# EAGLE design CentralBoard (EAGLE 9.2.2)
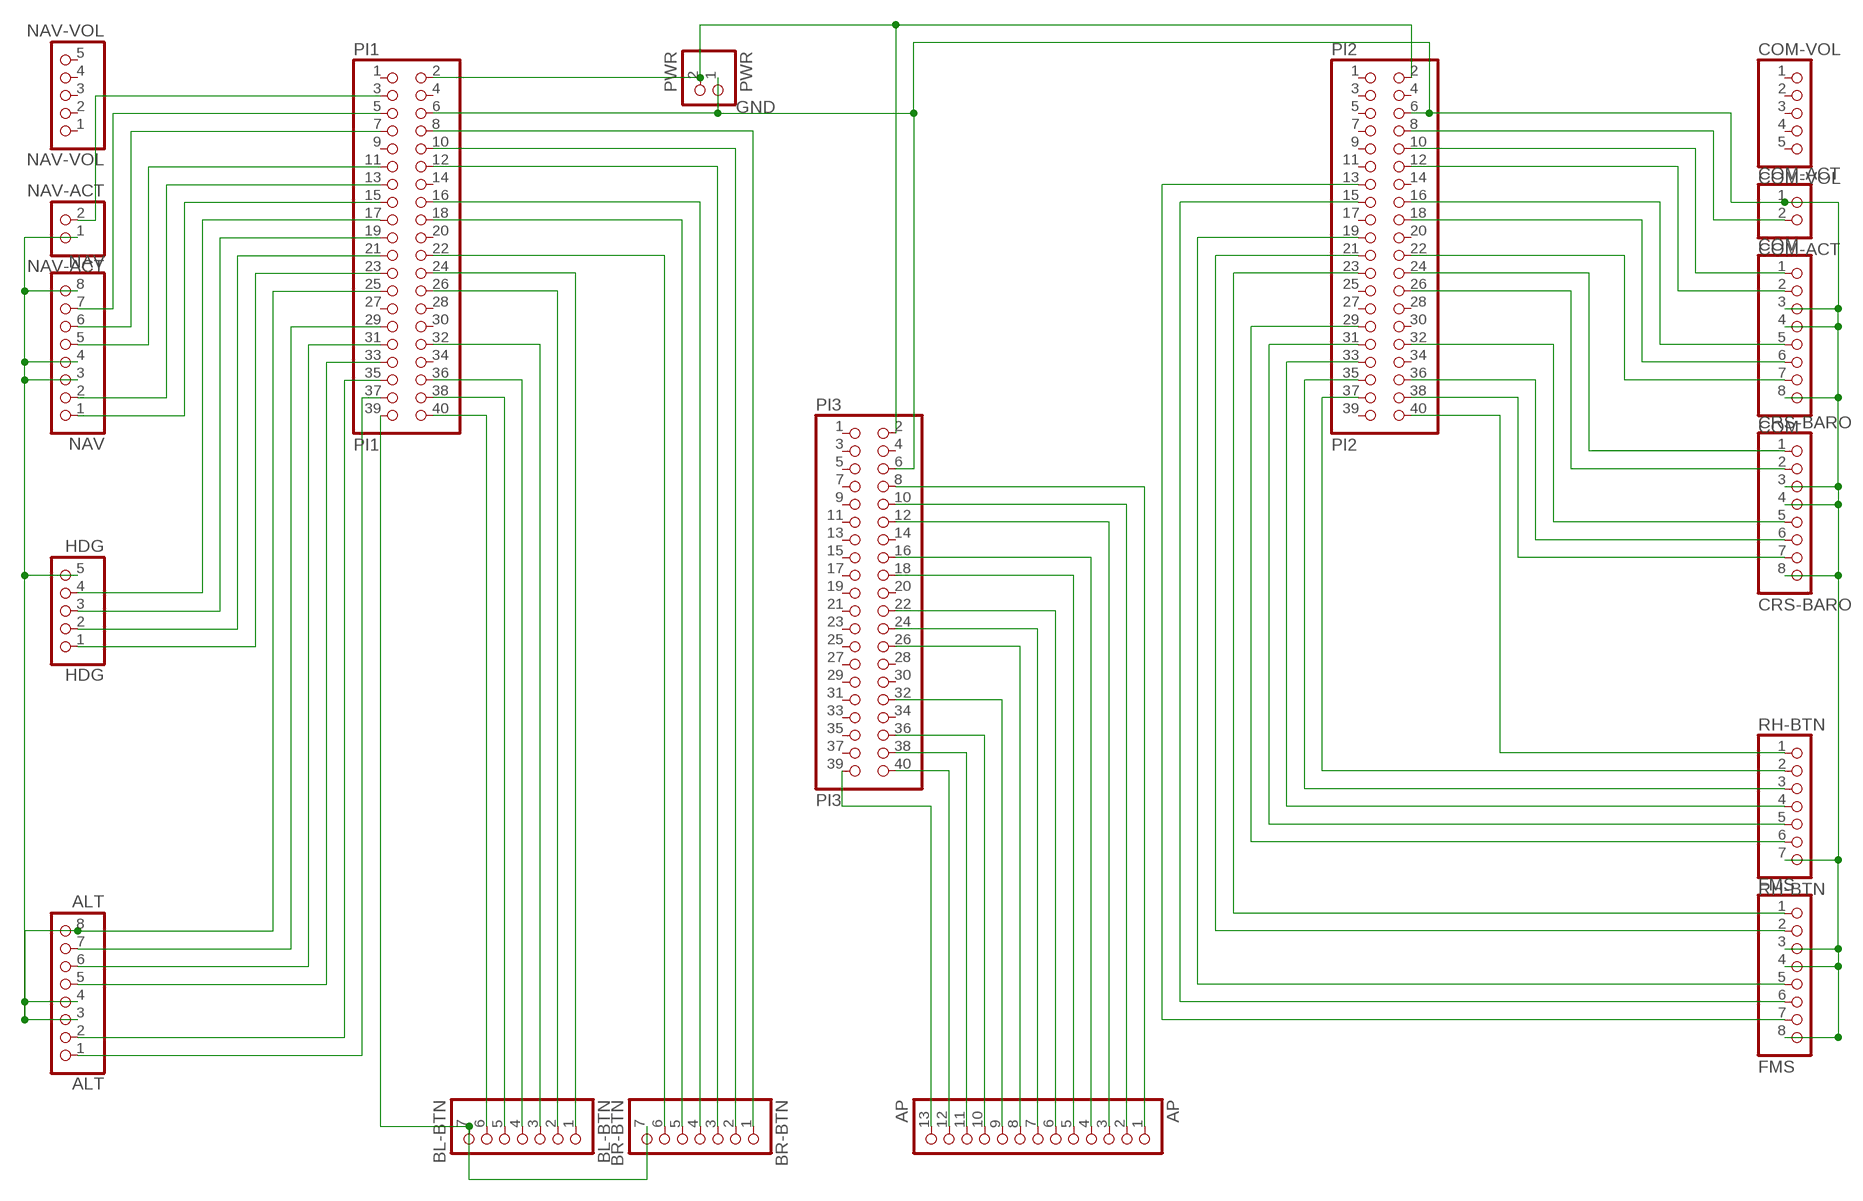
[diagram p0: schematic, sheet 1]

## Parts
ALT  ALT  PINHD-1X8/90  [1X08/90]
AP  AP  PINHD-1X13  [1X13]
BL-BTN  BL-BTN  PINHD-1X7/90  [1X07/90]
BR-BTN  BR-BTN  PINHD-1X7  [1X07]
COM  COM  PINHD-1X8/90  [1X08/90]
COM-ACT  COM-ACT  PINHD-1X2/90  [1X02/90]
COM-VOL  COM-VOL  PINHD-1X5/90  [1X05/90]
CRS-BARO  CRS-BARO  PINHD-1X8/90  [1X08/90]
FMS  FMS  PINHD-1X8/90  [1X08/90]
HDG  HDG  PINHD-1X5/90  [1X05/90]
NAV  NAV  PINHD-1X8/90  [1X08/90]
NAV-ACT  NAV-ACT  PINHD-1X2/90  [1X02/90]
NAV-VOL  NAV-VOL  PINHD-1X5/90  [1X05/90]
PI1  PI1  PINHD-2X20  [2X20]
PI2  PI2  PINHD-2X20  [2X20]
PI3  PI3  PINHD-2X20  [2X20]
PWR  PWR  PINHD-1X2/90  [1X02/90]
RH-BTN  RH-BTN  PINHD-1X7/90  [1X07/90]

## Nets
GND [power]: COM-ACT.1 COM.3 COM.4 COM.8 CRS-BARO.3 CRS-BARO.4 CRS-BARO.8 FMS.3 FMS.4 FMS.8 PI1.6 PI2.6 PI3.6 PWR.1 RH-BTN.7
N$1: CRS-BARO.6 PI2.36
N$2: HDG.3 PI1.19
N$3: BL-BTN.7 BR-BTN.7 PI1.39
N$4: CRS-BARO.7 PI2.38
N$5: BL-BTN.6 PI1.40
N$6: BL-BTN.5 PI1.38
N$7: ALT.7 PI1.29
N$8: ALT.3 ALT.4 ALT.8 HDG.5 NAV-ACT.1 NAV.3 NAV.4 NAV.8 PI1.25
N$9: NAV.7 PI1.5
N$10: NAV.6 PI1.7
N$11: NAV.2 PI1.13
N$12: NAV.1 PI1.15
N$13: NAV.5 PI1.11
N$14: HDG.2 PI1.21
N$15: HDG.1 PI1.23
N$16: COM.2 PI2.12
N$17: ALT.6 PI1.31
N$18: ALT.5 PI1.33
N$19: ALT.2 PI1.35
N$20: ALT.1 PI1.37
N$21: NAV-ACT.2 PI1.3
N$22: BR-BTN.6 PI1.22
N$23: BR-BTN.5 PI1.18
N$24: HDG.4 PI1.17
N$25: BL-BTN.4 PI1.36
N$26: BL-BTN.3 PI1.32
N$27: BL-BTN.2 PI1.26
N$28: BL-BTN.1 PI1.24
N$29: BR-BTN.4 PI1.16
N$30: BR-BTN.3 PI1.12
N$31: BR-BTN.2 PI1.10
N$32: BR-BTN.1 PI1.8
N$33: COM.1 PI2.10
N$34: COM-ACT.2 PI2.8
N$35: PI2.31 RH-BTN.5
N$36: FMS.2 PI2.21
N$37: PI2.29 RH-BTN.6
N$38: AP.2 PI3.10
N$39: AP.3 PI3.12
N$40: AP.1 PI3.8
N$41: CRS-BARO.1 PI2.24
N$42: CRS-BARO.2 PI2.26
N$43: CRS-BARO.5 PI2.32
N$44: AP.4 PI3.16
N$45: FMS.5 PI2.19
N$46: AP.5 PI3.18
N$47: AP.6 PI3.22
N$48: PI2.40 RH-BTN.1
N$49: PI2.37 RH-BTN.2
N$50: PI2.35 RH-BTN.3
N$51: PI2.33 RH-BTN.4
N$52: AP.7 PI3.24
N$53: FMS.1 PI2.23
N$54: AP.8 PI3.26
N$55: AP.9 PI3.32
N$56: FMS.6 PI2.15
N$57: FMS.7 PI2.13
N$58: AP.10 PI3.36
N$59: AP.11 PI3.38
N$60: AP.12 PI3.40
N$61: AP.13 PI3.39
N$63 [power]: PI1.2 PI2.2 PI3.2 PWR.2
N$77: COM.5 PI2.16
N$78: COM.6 PI2.18
N$79: COM.7 PI2.22
Unconnected: COM-VOL.1 COM-VOL.2 COM-VOL.3 COM-VOL.4 COM-VOL.5 NAV-VOL.1 NAV-VOL.2 NAV-VOL.3 NAV-VOL.4 NAV-VOL.5 PI1.1 PI1.4 PI1.9 PI1.14 PI1.20 PI1.27 PI1.28 PI1.30 PI1.34 PI2.1 PI2.3 PI2.4 PI2.5 PI2.7 PI2.9 PI2.11 PI2.14 PI2.17 PI2.20 PI2.25 PI2.27 PI2.28 PI2.30 PI2.34 PI2.39 PI3.1 PI3.3 PI3.4 PI3.5 PI3.7 PI3.9 PI3.11 PI3.13 PI3.14 PI3.15 PI3.17 PI3.19 PI3.20 PI3.21 PI3.23 PI3.25 PI3.27 PI3.28 PI3.29 PI3.30 PI3.31 PI3.33 PI3.34 PI3.35 PI3.37

## Library data of the parts
ALT COM CRS-BARO FMS NAV = pinhead:PINHD-1X8: PIN HEADER
AP = pinhead:PINHD-1X13: PIN HEADER
BL-BTN BR-BTN RH-BTN = pinhead:PINHD-1X7: PIN HEADER
COM-ACT NAV-ACT PWR = pinhead:PINHD-1X2: PIN HEADER
COM-VOL HDG NAV-VOL = pinhead:PINHD-1X5: PIN HEADER
PI1-PI3 = pinhead:PINHD-2X20: PIN HEADER

## Net classes
0 default: width 0.254 mm, clearance 0.203 mm
1 power: width 1.372 mm, clearance 0.203 mm

## Board
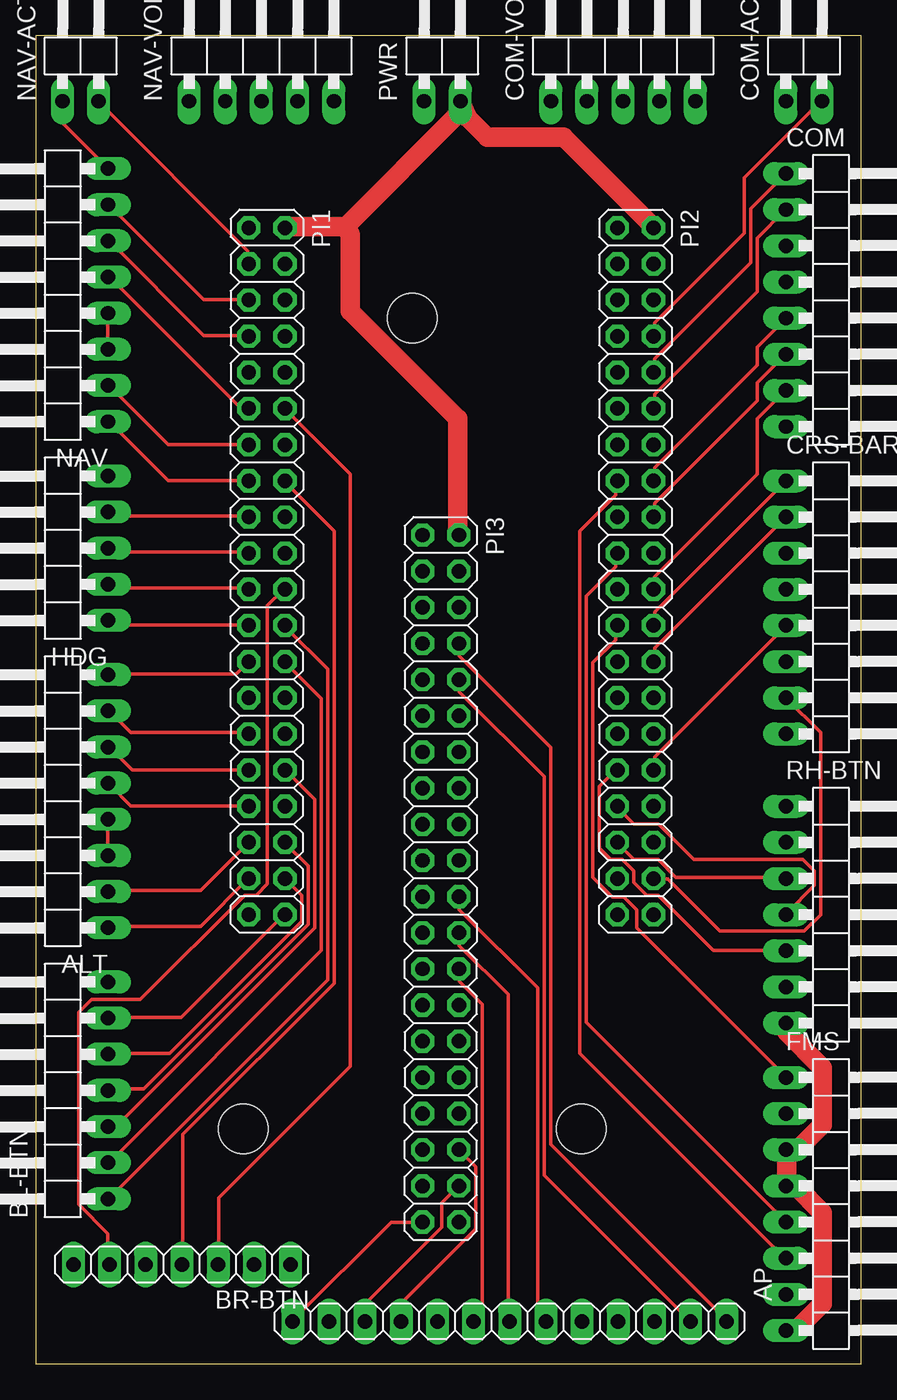
[diagram p1: board, top side]
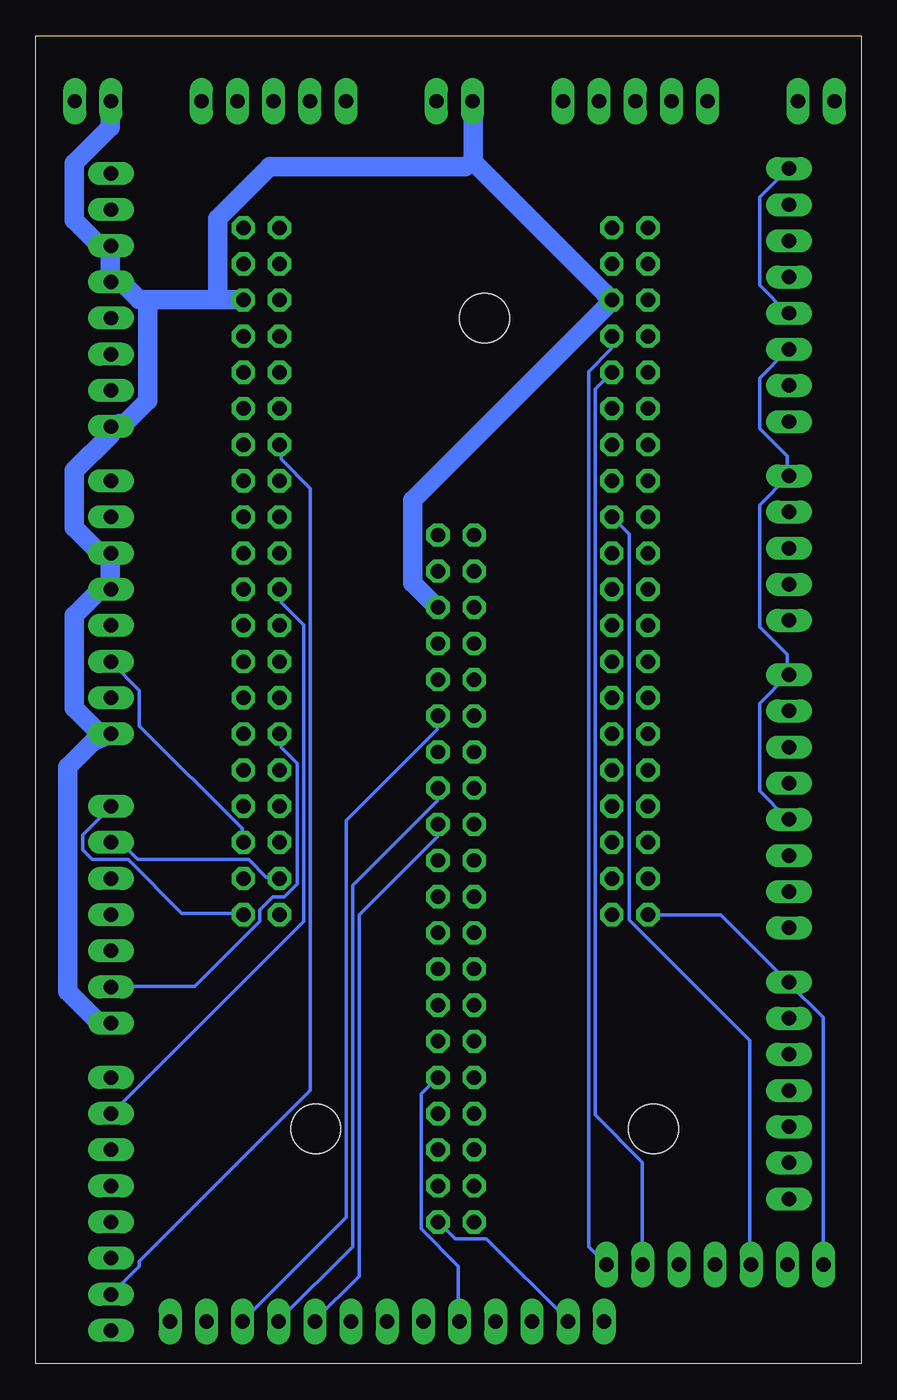
[diagram p2: board, bottom side, seen from below]

Size 57.98 x 93.32 mm. Coordinates in mm from the lower left corner, seen from the top.
Outline: 0,0 57.98,0 57.98,93.32 0,93.32 0,0
Copper layers (1*16): Top 0.035mm / dielectric 1.5mm / Bottom 0.035mm
Design rules "SparkFun": minimum track width 8mil, minimum drill 20mil, track to track 8mil, track to pad 8mil, pad to pad 8mil, via to via 8mil, smd to smd 8mil, copper to edge 10mil, drill to drill 8mil, minimum pad ring 12mil, minimum via ring 10mil, stop-mask expansion 4mil, vias tented up to drill 25mil, thermal gap 10mil
Holes 3.5 mm at 26.45,73.47 14.59,16.51 38.31,16.51

### Footprints (pad centres in the part's own frame; a part is rotated, then mirrored left to right if it is on the bottom)
1X08/90 = drill 1.016 long: 1 -8.89,-3.81; 2 -6.35,-3.81; 3 -3.81,-3.81; 4 -1.27,-3.81; 5 1.27,-3.81; 6 3.81,-3.81; 7 6.35,-3.81; 8 8.89,-3.81
1X13 = drill 1.016 long: 1 -15.24,0; 2 -12.7,0; 3 -10.16,0; 4 -7.62,0; 5 -5.08,0; 6 -2.54,0; 7 0,0; 8 2.54,0; 9 5.08,0; 10 7.62,0; 11 10.16,0; 12 12.7,0; 13 15.24,0
1X07/90 = drill 1.016 long: 1 -7.62,-3.81; 2 -5.08,-3.81; 3 -2.54,-3.81; 4 0,-3.81; 5 2.54,-3.81; 6 5.08,-3.81; 7 7.62,-3.81
1X07 = drill 1.016 long: 1 -7.62,0; 2 -5.08,0; 3 -2.54,0; 4 0,0; 5 2.54,0; 6 5.08,0; 7 7.62,0
1X02/90 = drill 1.016 long: 1 -1.27,-3.81; 2 1.27,-3.81
1X05/90 = drill 1.016 long: 1 -5.08,-3.81; 2 -2.54,-3.81; 3 0,-3.81; 4 2.54,-3.81; 5 5.08,-3.81
2X20 = drill 1.016 octagon: 1 -24.13,-1.27; 2 -24.13,1.27; 3 -21.59,-1.27; 4 -21.59,1.27; 5 -19.05,-1.27; 6 -19.05,1.27; 7 -16.51,-1.27; 8 -16.51,1.27; 9 -13.97,-1.27; 10 -13.97,1.27; 11 -11.43,-1.27; 12 -11.43,1.27; 13 -8.89,-1.27; 14 -8.89,1.27; 15 -6.35,-1.27; 16 -6.35,1.27; 17 -3.81,-1.27; 18 -3.81,1.27; 19 -1.27,-1.27; 20 -1.27,1.27; 21 1.27,-1.27; 22 1.27,1.27; 23 3.81,-1.27; 24 3.81,1.27; 25 6.35,-1.27; 26 6.35,1.27; 27 8.89,-1.27; 28 8.89,1.27; 29 11.43,-1.27; 30 11.43,1.27; 31 13.97,-1.27; 32 13.97,1.27; 33 16.51,-1.27; 34 16.51,1.27; 35 19.05,-1.27; 36 19.05,1.27; 37 21.59,-1.27; 38 21.59,1.27; 39 24.13,-1.27; 40 24.13,1.27

### Placement (x,y rotation side)
ALT  1.27,39.53 90 top
AP  33.29,2.99 180 top
BL-BTN  1.27,19.21 90 top
BR-BTN  10.27,6.98 180 top
COM  56.5,74.74 270 top
COM-ACT  53.96,92.52 0 top
COM-VOL  41.26,92.52 0 top
CRS-BARO  56.5,53.15 270 top
FMS  56.5,11.24 270 top
HDG  1.27,57.31 90 top
NAV  1.27,75.09 90 top
NAV-ACT  3.16,92.52 0 top
NAV-VOL  15.86,92.52 0 top
PI1  16.24,55.69 270 top
PI2  42.12,55.69 270 top
PI3  28.45,34.1 270 top
PWR  28.56,92.52 0 top
RH-BTN  56.5,31.56 270 top

### Tracks (layer width: path | path; a pad name or v marks a point on that pad's centre or on a via)
GND
  Top 1.372: FMS.8 52.74,2.4 53.43,2.4 55.25,4.23 55.25,10.63 53.43,12.46 52.74,12.46 FMS.4 52.74,13.14 52.74,14.97 FMS.3 53.43,14.97 55.25,16.8 55.25,20.8 52.74,23.32 52.74,23.89 RH-BTN.7
  Bottom 1.372: PI3.6 29.77,53.15 31.48,54.86 31.48,60.69 17.54,74.64 PI1.6 17.99,75.21 27.25,84.47 | 27.25,84.47 27.25,88.7 PWR.1 | 50.11,74.75 50.68,74.75 51.94,76.01 COM.4 52.74,76.58 52.74,78.53 COM.3 53.43,78.53 55.25,80.35 55.25,84.35 52.74,86.87 52.74,88.7 COM-ACT.1 | 50.11,74.75 45.2,74.75 | 45.2,74.75 43.48,74.75 PI2.6 | RH-BTN.7 52.74,24 53.54,24 55.71,26.18 55.71,41.95 53.88,43.78 CRS-BARO.8 52.74,44.35 53.54,44.35 55.25,46.06 55.25,52.58 53.43,54.41 52.74,54.41 CRS-BARO.4 52.74,55.09 52.74,56.92 CRS-BARO.3 53.43,56.92 55.25,58.75 55.25,62.75 52.74,65.27 52.74,65.84 COM.8 52.05,66.07 51.71,66.07 50.11,67.67 50.11,74.75 | 45.2,74.75 45.2,80.47 41.54,84.12 27.82,84.12 27.25,84.47
N$1
  Bottom 0.254: PI2.36 43.48,36.69 43.48,37.6 50.68,44.81 50.68,47.32 52.63,49.26 CRS-BARO.6
N$2
  Top 0.254: PI1.19 14.91,57.04 5.42,57.04 5.19,57.27 HDG.3
N$3
  Bottom 0.254: BR-BTN.7 2.68,7.09 2.68,24.35 5.08,26.75 BL-BTN.7 5.19,26.86 9.88,31.55 14.91,31.55 PI1.39
N$4
  Top 0.254: CRS-BARO.7 55.14,44.35 55.14,31.55 54,30.4 48.05,30.4 44.4,34.06 43.48,34.06 PI2.38
N$5
  Top 0.254: BL-BTN.6 5.19,24.35 10.22,24.35 17.42,31.55 PI1.40
N$6
  Top 0.254: BL-BTN.5 5.19,21.83 9.42,21.83 18.68,31.09 18.68,32.92 17.54,34.06 PI1.38
N$7
  Top 0.254: PI1.29 14.91,44.35 6.68,44.35 5.19,45.84 ALT.7
N$8
  Top 0.254: ALT.3 5.08,35.78 5.08,38.18 ALT.4 | ALT.8 5.19,48.46 14.11,48.46 14.91,49.26 PI1.25 | NAV-ACT.1 1.99,88.7 1.99,87.1 5.08,84.01 NAV.8 | NAV.4 5.08,73.72 5.08,71.32 NAV.3
  Bottom 0.254: ALT.4 5.19,38.29 7.13,40.23 7.13,46.41 5.19,48.35 ALT.8 5.19,48.46 5.19,49.84 7.13,51.78 7.13,60.35 5.19,62.29 HDG.5 5.19,62.41 5.19,63.78 7.13,65.72 7.13,69.27 5.19,71.21 NAV.3 | NAV.8 5.19,83.9 7.13,81.95 7.13,75.78 5.19,73.84 NAV.4
N$9
  Top 0.254: PI1.5 14.91,74.75 11.82,74.75 5.19,81.38 NAV.7
N$10
  Top 0.254: PI1.7 14.91,72.24 11.82,72.24 5.19,78.87 NAV.6
N$11
  Top 0.254: PI1.13 9.31,64.58 5.19,68.69 NAV.2
N$12
  Top 0.254: PI1.15 14.91,62.06 9.31,62.06 5.19,66.18 NAV.1
N$13
  Top 0.254: PI1.11 14.91,67.21 14.34,67.21 5.19,76.35 NAV.5
N$14
  Top 0.254: PI1.21 14.91,54.52 5.42,54.52 5.19,54.75 HDG.2
N$15
  Top 0.254: PI1.23 14.91,51.89 5.42,51.89 5.19,52.12 HDG.1
N$16
  Top 0.254: PI2.12 43.48,67.21 43.48,68.12 50.68,75.32 50.68,79.1 52.63,81.04 COM.2
N$17
  Top 0.254: PI1.31 6.79,41.72 5.19,43.32 ALT.6
N$18
  Top 0.254: PI1.33 14.91,39.2 6.68,39.2 5.19,40.69 ALT.5
N$19
  Top 0.254: ALT.2 5.19,33.26 11.59,33.26 14.91,36.58 PI1.35
N$20
  Top 0.254: ALT.1 5.19,30.75 11.59,30.75 14.91,34.06 PI1.37
N$21
  Top 0.254: PI1.3 14.91,77.38 14.91,78.18 4.39,88.7 NAV-ACT.2
N$22
  Top 0.254: BR-BTN.6 5.08,7.09 5.08,9.14 3.02,11.2 3.02,24.69 3.93,25.6 7.36,25.6 14.68,32.92 15.48,32.92 16.28,33.72 16.28,53.26 17.42,54.41 PI1.22
N$23
  Bottom 0.254: BR-BTN.5 7.82,7.09 7.82,22.75 16.28,31.2 16.28,58.29 17.42,59.44 PI1.18
N$24
  Top 0.254: PI1.17 14.91,59.55 5.42,59.55 5.19,59.78 HDG.4
N$25
  Top 0.254: BL-BTN.4 5.19,19.32 7.59,19.32 19.14,30.86 19.14,34.98 17.54,36.58 PI1.36
N$26
  Top 0.254: BL-BTN.3 5.19,16.69 5.65,16.69 19.59,30.63 19.59,39.66 17.54,41.72 PI1.32
N$27
  Top 0.254: BL-BTN.2 5.19,14.17 20.05,29.03 20.05,46.75 17.54,49.26 PI1.26
N$28
  Top 0.254: BL-BTN.1 5.19,11.66 20.51,26.98 20.51,48.81 17.54,51.78 PI1.24
N$29
  Top 0.254: BR-BTN.4 10.33,7.09 10.33,16.12 20.96,26.75 20.96,58.52 17.54,61.95 PI1.16
N$30
  Top 0.254: BR-BTN.3 12.85,7.09 12.85,11.66 22.11,20.92 22.11,62.52 17.54,67.09 PI1.12
N$31
  Bottom 0.254: BR-BTN.2 15.37,7.09 15.37,14.17 18.68,17.49 18.68,68.47 17.54,69.61 PI1.10
N$32
  Bottom 0.254: PI1.8 17.54,72.12 17.54,71.32 19.14,69.72 19.14,8.23 17.99,7.09 BR-BTN.1
N$33
  Top 0.254: PI2.10 43.48,69.72 43.48,70.64 50.23,77.38 50.23,81.15 52.63,83.55 COM.1
N$34
  Top 0.254: PI2.8 43.48,72.24 43.48,73.15 49.77,79.44 49.77,83.33 55.14,88.7 COM-ACT.2
N$35
  Top 0.254: RH-BTN.5 52.63,29.03 47.6,29.03 43.71,32.92 42.91,32.92 42,33.83 42,34.63 41.2,35.43 40.4,35.43 39.6,36.23 39.6,40.58 40.74,41.72 PI2.31
N$36
  Bottom 0.254: PI2.21 40.74,54.41 40.74,53.49 39.14,51.89 39.14,31.09 52.63,17.6 FMS.2
N$37
  Bottom 0.254: PI2.29 40.74,44.23 40.74,43.32 39.6,42.18 39.6,33.72 40.51,32.8 41.31,32.8 42.22,31.89 42.22,31.09 46.8,26.52 52.63,26.52 RH-BTN.6
N$38
  Top 0.254: PI3.10 29.77,48.01 29.77,47.21 35.71,41.26 35.71,13.26 45.88,3.09 AP.2
N$39
  Bottom 0.254: PI3.12 29.77,45.49 29.77,44.58 36.17,38.18 36.17,10.29 43.37,3.09 AP.3
N$40
  Top 0.254: PI3.8 29.77,50.52 29.77,49.72 36.17,43.32 36.17,15.43 48.51,3.09 AP.1
N$41
  Top 0.254: PI2.24 43.48,51.89 43.48,52.81 52.63,61.95 CRS-BARO.1
N$42
  Top 0.254: CRS-BARO.2 43.48,50.29 43.48,49.38 PI2.26
N$43
  Top 0.254: PI2.32 43.48,41.72 43.48,42.63 52.63,51.78 CRS-BARO.5
N$44
  Bottom 0.254: PI3.16 29.77,40.35 29.77,39.55 35.71,33.6 35.71,8.23 40.85,3.09 AP.4
N$45
  Top 0.254: PI2.19 40.74,56.92 40.74,56.01 38.68,53.95 38.68,24 52.63,10.06 FMS.5
N$46
  Bottom 0.254: PI3.18 29.77,37.83 29.77,37.03 35.25,31.55 35.25,6.17 38.34,3.09 AP.5
N$47
  Top 0.254: PI3.22 29.77,32.8 29.77,31.89 35.25,26.4 35.25,3.66 35.82,3.09 AP.6
N$48
  Bottom 0.254: PI2.40 43.48,31.66 47.71,31.66 51.48,35.43 54,35.43 54.68,36.12 54.68,37.15 52.74,39.09 RH-BTN.1
N$49
  Bottom 0.254: PI2.37 40.85,34.18 41.77,34.18 43.02,35.43 50.8,35.43 51.94,36.58 52.63,36.58 RH-BTN.2
N$50
  Top 0.254: RH-BTN.3 52.63,34.18 44.97,34.18 43.71,35.43 42,35.43 40.85,36.58 PI2.35
N$51
  Top 0.254: RH-BTN.4 52.74,31.66 54.68,33.6 54.68,34.63 53.88,35.43 46.23,35.43 43.71,37.95 42,37.95 40.85,39.09 PI2.33
N$52
  Top 0.254: PI3.24 29.77,30.29 29.77,29.38 33.2,25.95 33.2,3.09 AP.7
N$53
  Top 0.254: PI2.23 40.74,51.78 40.74,50.86 39.14,49.26 39.14,34.18 40.51,32.8 41.31,32.8 42.22,31.89 42.22,30.63 52.63,20.23 FMS.1
N$54
  Top 0.254: PI3.26 29.77,27.66 29.77,26.86 31.37,25.26 31.37,3.66 30.79,3.09 AP.8
N$55
  Bottom 0.254: AP.9 28.28,3.09 28.28,6.86 30.91,9.49 30.91,18.97 29.77,20.12 PI3.32
N$56
  Top 0.254: PI2.15 40.74,61.95 40.74,61.04 38.22,58.52 38.22,21.83 52.63,7.43 FMS.6
N$57
  Bottom 0.254: PI2.13 40.74,64.58 40.74,63.55 38.68,61.49 38.68,19.2 50.68,7.2 50.68,6.86 52.63,4.91 FMS.7
N$58
  Top 0.254: AP.10 25.77,3.09 25.77,4.34 30.91,9.49 30.91,13.83 29.77,14.97 PI3.36
N$59
  Top 0.254: AP.11 23.14,3.09 23.14,4.23 28.51,9.6 28.51,11.32 29.65,12.46 PI3.38
N$60
  Bottom 0.254: AP.12 20.62,3.09 26.34,8.8 28.51,8.8 29.65,9.95 PI3.40
N$61
  Top 0.254: AP.13 18.11,3.09 24.97,9.95 27.14,9.95 PI3.39
N$63
  Top 1.372: 21.77,79.9 17.54,79.9 PI1.2 | 21.77,79.9 29.77,87.9 29.77,88.7 PWR.2 30.34,87.55 31.71,86.18 37.08,86.18 43.37,79.9 PI2.2 | PI3.2 29.65,58.29 29.65,66.41 22.11,73.95 22.11,79.33 21.77,79.9
N$77
  Top 0.254: PI2.16 43.48,62.06 43.48,62.98 50.68,70.18 50.68,71.44 52.63,73.38 COM.5
N$78
  Top 0.254: COM.6 50.68,68.92 50.68,67.67 43.48,60.47 43.48,59.55 PI2.18
N$79
  Top 0.254: PI2.22 43.48,54.52 43.48,55.32 50.68,62.52 50.68,66.41 52.63,68.35 COM.7